# EAGLE design AudioPreAmp-LM741 (EAGLE 7.2.0)
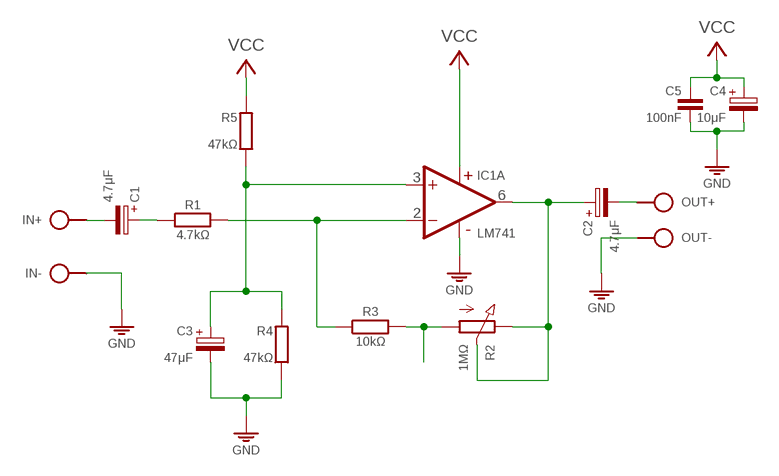
[diagram p0: schematic, sheet 1]

## Parts
C1  4.7μF  CPOLE2,5-4/V  [E2.5-4/V]
C2  4.7μF  CPOLE2,5-4  [E2,5-4]
C3  47μF  CPOLE2,5-4  [E2,5-4]
C4  10μF  CPOLE2,5-4  [E2,5-4]
C5  100nF  C050-020X044/V  [C050-020X044/V]
IC1  LM741  [DIL08]
IN  SPAD+--+  [SPAD-+]
OUT  SPAD+-+-  [SPAD+-]
PWR  VCC_GNDL  [SPAD-+]
R1  4.7kΩ  R-H0204/10  [0204/10]
R2  1MΩ  POT-P5  [POT-P5]
R3  10kΩ  R-H0204/10-V  [0204/10-V]
R4  47kΩ  R0204/10-V  [0204/10-V]
R5  47kΩ  R0204/10  [0204/10]

## Nets
GND: C3.- C4.- C5.2 IC1.4(2:V-) IN.1 OUT.1 PWR.1 R4.2
N$1: R2.A R3.2
N$2: C1.+ R1.1
N$3: IC1.2(A:-IN) R1.2 R3.1
N$4: C3.+ IC1.3(A:+IN) R4.1 R5.1
N$5: C2.- OUT.2
N$7: C1.- IN.2
N$8: C2.+ IC1.6(A:OUT) R2.E R2.S
VCC: C4.+ C5.1 IC1.7(2:V+) PWR.2 R5.2

## Library data of the parts
C1-C4 = c:CPOL: POLARIZED CAPACITOR, European symbol
C5 = c:C: CAPACITOR, European symbol
IC1 = ic:LM741
IN OUT = pad:SPAD+-
PWR = pad:VCC_GND
R1 R3 = r:R-H
R2 = r:POT
R4 R5 = r:R: RESISTOR, European symbol

## Board
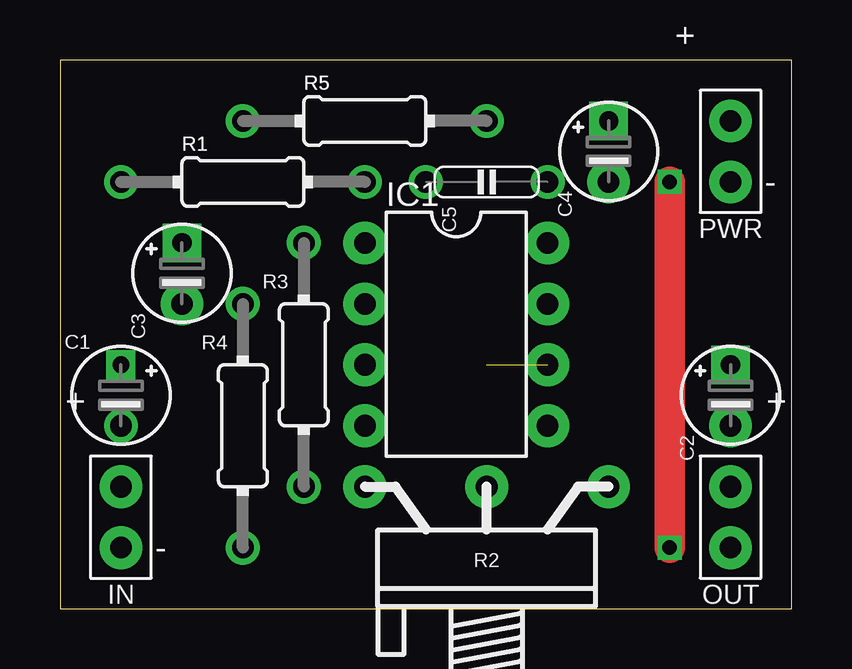
[diagram p1: board, top side]
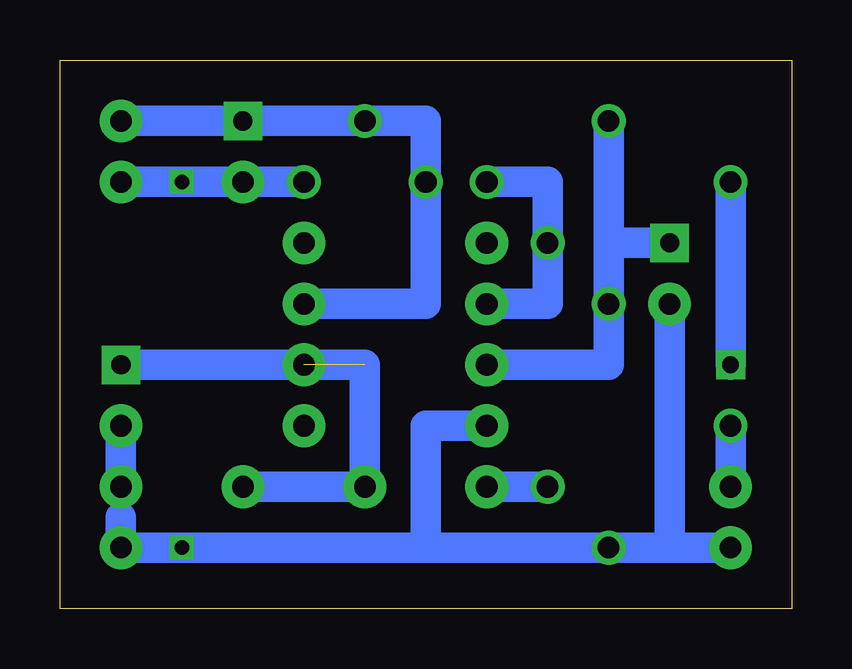
[diagram p2: board, bottom side, seen from below]

Size 30.48 x 22.86 mm. Coordinates in mm from the lower left corner, seen from the top.
Outline: 0,0 30.48,0 30.48,22.86 0,22.86 0,0
Copper layers (1*16): Top 0.035mm / dielectric 1.5mm / Bottom 0.035mm
Design rules "default": minimum track width 10mil, minimum drill 24mil, track to track 8mil, track to pad 8mil, pad to pad 8mil, via to via 8mil, smd to smd 8mil, copper to edge 40mil, drill to drill 8mil, minimum pad ring 10mil, minimum via ring 8mil, stop-mask expansion 4mil, vias tented up to drill 0mil, thermal gap 10mil

### Footprints (pad centres in the part's own frame; a part is rotated, then mirrored left to right if it is on the bottom)
E2.5-4/V = drill 0.7 square: + 0,1.27 | drill 0.9: - 0,-1.27
E2,5-4 = drill 0.8 pad 1.6 square: + 1.27,0 | drill 0.9 pad 1.778: - -1.27,0
C050-020X044/V = drill 0.9: 1 0,2.54; 2 0,-2.54
DIL08 = drill 0.9 pad 1.778: 1 -3.81,-3.81; 2 -1.27,-3.81; 3 1.27,-3.81; 4 3.81,-3.81; 5 3.81,3.81; 6 1.27,3.81; 7 -1.27,3.81; 8 -3.81,3.81
SPAD-+ = drill 0.9 pad 1.778: 1 0,-1.27; 2 0,1.27
SPAD+- = drill 0.9 pad 1.778: 1 0,-1.27; 2 0,1.27
0204/10 = drill 0.9: 1 -5.08,0; 2 5.08,0
POT-P5 = drill 0.9 pad 1.778: A -5.08,2.54; E 5.08,2.54; S 0,2.54
0204/10-V = drill 0.9: 1 0,5.08; 2 0,-5.08

### Placement (x,y rotation side)
C1  2.54,8.89 0 top
C2  27.94,8.89 90 top
C3  5.08,13.97 90 top
C4  22.86,19.05 90 top
C5  17.78,17.78 90 top
IC1  16.51,11.43 270 top
IN  2.54,3.81 0 top
OUT  27.94,3.81 0 top
PWR  27.94,19.05 0 top
R1  7.62,17.78 0 top
R2  17.78,2.54 0 top
R3  10.16,10.16 0 top
R4  7.62,7.62 0 top
R5  12.7,20.32 0 top

### Tracks (layer width: path | path; a pad name or v marks a point on that pad's centre or on a via)
GND  (via drill 0.6)
  Top 1.27: v25.4,2.54 v25.4,17.78
  Bottom 1.27: R4.2 IN.1 | C3.- 5.08,2.54 R4.2 | R4.2 15.24,2.54 | IC1.4 15.24,7.62 15.24,2.54 | 15.24,2.54 v25.4,2.54 OUT.1 27.94,3.81 | C5.2 C4.- v25.4,17.78 PWR.1
N$1
  Bottom 1.27: R2.A R3.2
N$2
  Bottom 1.27: R1.1 C1.+
N$3
  Bottom 1.27: IC1.2 10.16,12.7 R3.1 10.16,17.78 R1.2
N$4
  Bottom 1.27: R4.1 7.62,15.24 C3.+ | R5.1 R4.1 | R4.1 7.62,10.16 IC1.3
N$5
  Bottom 1.27: C2.- OUT.2
N$7
  Bottom 1.27: IN.2 C1.-
N$8  (1 unrouted)
  Bottom 1.27: C2.+ 17.78,10.16 R2.S R2.E
VCC
  Bottom 1.27: PWR.2 C4.+ R5.2 15.24,20.32 C5.1 15.24,15.24 15.24,12.7 IC1.7